# EAGLE design REV_A (EAGLE 7.2.0)
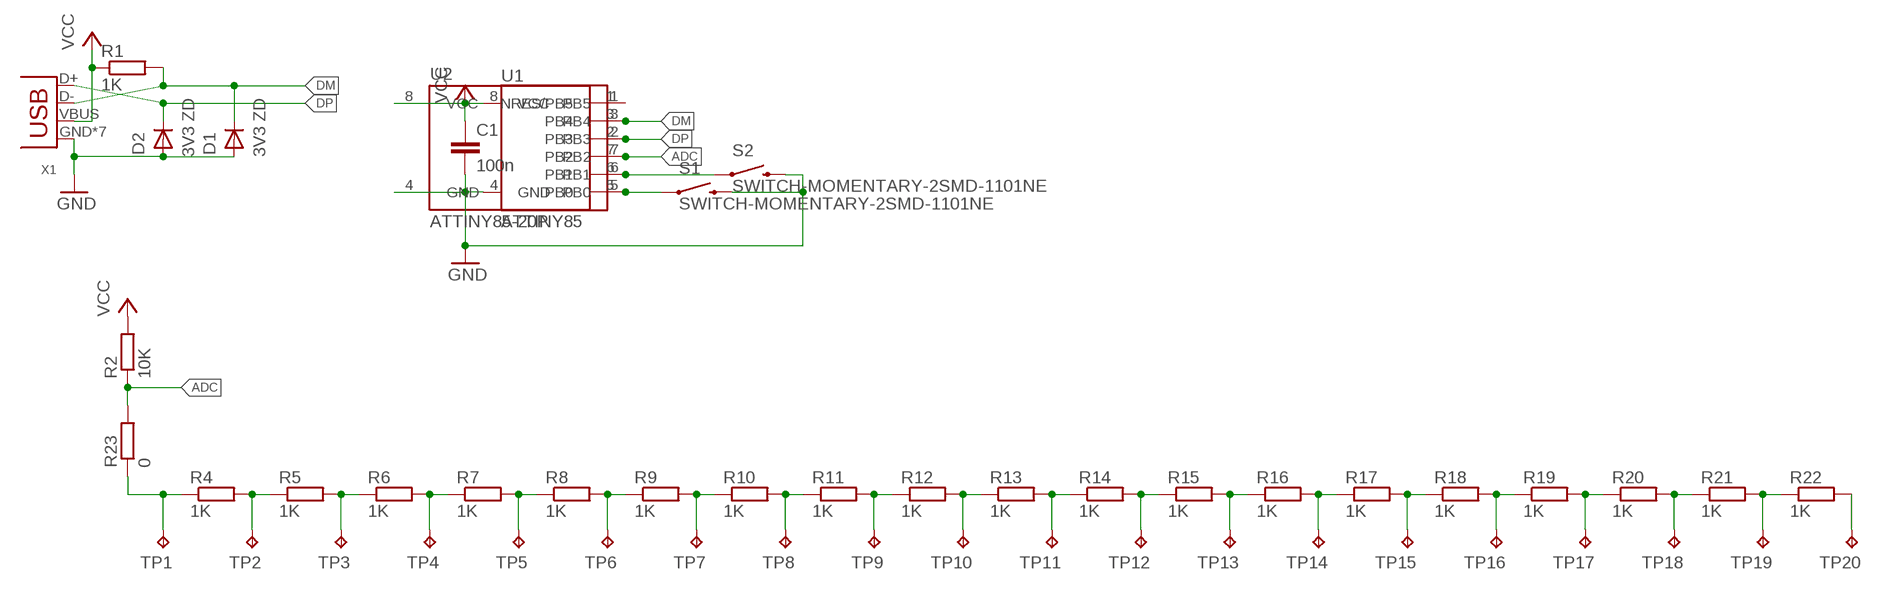
[diagram p0: schematic, sheet 1]

## Parts
C1  100n  C-EUC0805K  [C0805K]
D1  3V3 ZD  BAS32L  [SOD80C]
D2  3V3 ZD  BAS32L  [SOD80C]
R1  1K  R-EU_M0805  [M0805]
R2  10K  R-EU_M0805  [M0805]
R4  1K  R-EU_M0805  [M0805]
R5  1K  R-EU_M0805  [M0805]
R6  1K  R-EU_M0805  [M0805]
R7  1K  R-EU_M0805  [M0805]
R8  1K  R-EU_M0805  [M0805]
R9  1K  R-EU_M0805  [M0805]
R10  1K  R-EU_M0805  [M0805]
R11  1K  R-EU_M0805  [M0805]
R12  1K  R-EU_M0805  [M0805]
R13  1K  R-EU_M0805  [M0805]
R14  1K  R-EU_M0805  [M0805]
R15  1K  R-EU_M0805  [M0805]
R16  1K  R-EU_M0805  [M0805]
R17  1K  R-EU_M0805  [M0805]
R18  1K  R-EU_M0805  [M0805]
R19  1K  R-EU_M0805  [M0805]
R20  1K  R-EU_M0805  [M0805]
R21  1K  R-EU_M0805  [M0805]
R22  1K  R-EU_M0805  [M0805]
R23  0  R-EU_M1206  [M1206]
S1  SWITCH-MOMENTARY-2SMD-1101NE  [TACTILE-SWITCH-1101NE]
S2  SWITCH-MOMENTARY-2SMD-1101NE  [TACTILE-SWITCH-1101NE]
TP1  TPB1,27  [B1,27]
TP2  TPB1,27  [B1,27]
TP3  TPB1,27  [B1,27]
TP4  TPB1,27  [B1,27]
TP5  TPB1,27  [B1,27]
TP6  TPB1,27  [B1,27]
TP7  TPB1,27  [B1,27]
TP8  TPB1,27  [B1,27]
TP9  TPB1,27  [B1,27]
TP10  TPB1,27  [B1,27]
TP11  TPB1,27  [B1,27]
TP12  TPB1,27  [B1,27]
TP13  TPB1,27  [B1,27]
TP14  TPB1,27  [B1,27]
TP15  TPB1,27  [B1,27]
TP16  TPB1,27  [B1,27]
TP17  TPB1,27  [B1,27]
TP18  TPB1,27  [B1,27]
TP19  TPB1,27  [B1,27]
TP20  TPB1,27  [B1,27]
U1  ATTINY85  [ATTINY85]
U2  ATTINY85-20P  [PDIP08_300MIL]
X1  USB-MB-S  [USB-MB-S]

## Nets
1: R4.1 R23.1 TP1.TP
2: R4.2 R5.1 TP2.TP
3: R5.2 R6.1 TP3.TP
4: R6.2 R7.1 TP4.TP
5: R7.2 R8.1 TP5.TP
6: R8.2 R9.1 TP6.TP
7: R9.2 R10.1 TP7.TP
8: R10.2 R11.1 TP8.TP
9: R11.2 R12.1 TP9.TP
10: R12.2 R13.1 TP10.TP
11: R13.2 R14.1 TP11.TP
12: R14.2 R15.1 TP12.TP
13: R15.2 R16.1 TP13.TP
14: R16.2 R17.1 TP14.TP
15: R17.2 R18.1 TP15.TP
16: R18.2 R19.1 TP16.TP
17: R19.2 R20.1 TP17.TP
18: R20.2 R21.1 TP18.TP
19: R21.2 R22.1 TP19.TP
20: R22.2 TP20.TP
ADC: R2.1 R23.2 U1.7(PB2) U2.7(PB2)
DM: D1.1(K) R1.2 U1.3(PB4) U2.3(PB4) X1.D-
DP: D2.1(K) U1.2(PB3) U2.2(PB3) X1.D+
GND: C1.2 D1.2(A) D2.2(A) S1.2 S2.2 U1.4(GND) U2.4(GND) X1.GND X1.P$1(GND) X1.P$2(GND) X1.P$3(GND) X1.P$4(GND) X1.P$5(GND) X1.P$6(GND)
N$1: U1.1(PB5) U2.1(NRES/PB5)
N$20: S1.1 U1.5(PB0) U2.5(PB0)
N$21: S2.1 U1.6(PB1) U2.6(PB1)
VCC: C1.1 R1.1 R2.2 U1.8(VCC) U2.8(VCC) X1.VBUS

## Library data of the parts
C1 = rcl:C-EU: CAPACITOR, European symbol
D1 D2 = nxp_60:BAS32L: High-speed switching diode Single high-speed switching diode, fabricated in planar technology, and encapsulated in a small hermetically sealed glass SOD80C Surface-Mounted Device (SMD) package. AAL Eindhoven MK
R1 R2 R4-R23 = rcl:R-EU_: RESISTOR, European symbol
S1 S2 = SparkFun-Electromechanical:SWITCH-MOMENTARY-2: Various NO switches- pushbuttons, reed, etc; PROD_ID: SWCH-00815
TP1-TP20 = testpad:TP: Test pad
U1 = SparkFun-IC-Microcontroller:ATTINY85; PROD_ID: IC-09092
U2 = _hhn_attiny25_45_85:ATTINY85*: ATMEL ATtiny 85 Packages: P = PDIP 08 30mil S = SOIC 08 EIAJ 208mil Technologies Note: for complete ordering code (temp. range, finish, tape&reel etc.) see www.atmel.com • Supply Voltage: V = (1.8…5.5)V | [blank] = (2.7…5.5)V • Speed: 10 = 10 MHz | 20 = 20 MHz Author: Dipl.-Ing. FH Rainer Bayer HHN Hochschule Heilbronn (Heilbronn University), rainer.bayer@hs-heilbronn.de Ingenieurbüro ing-rb, mail@ing-rb.de
X1 = con-usb-3:USB: USB Connectors

## Board
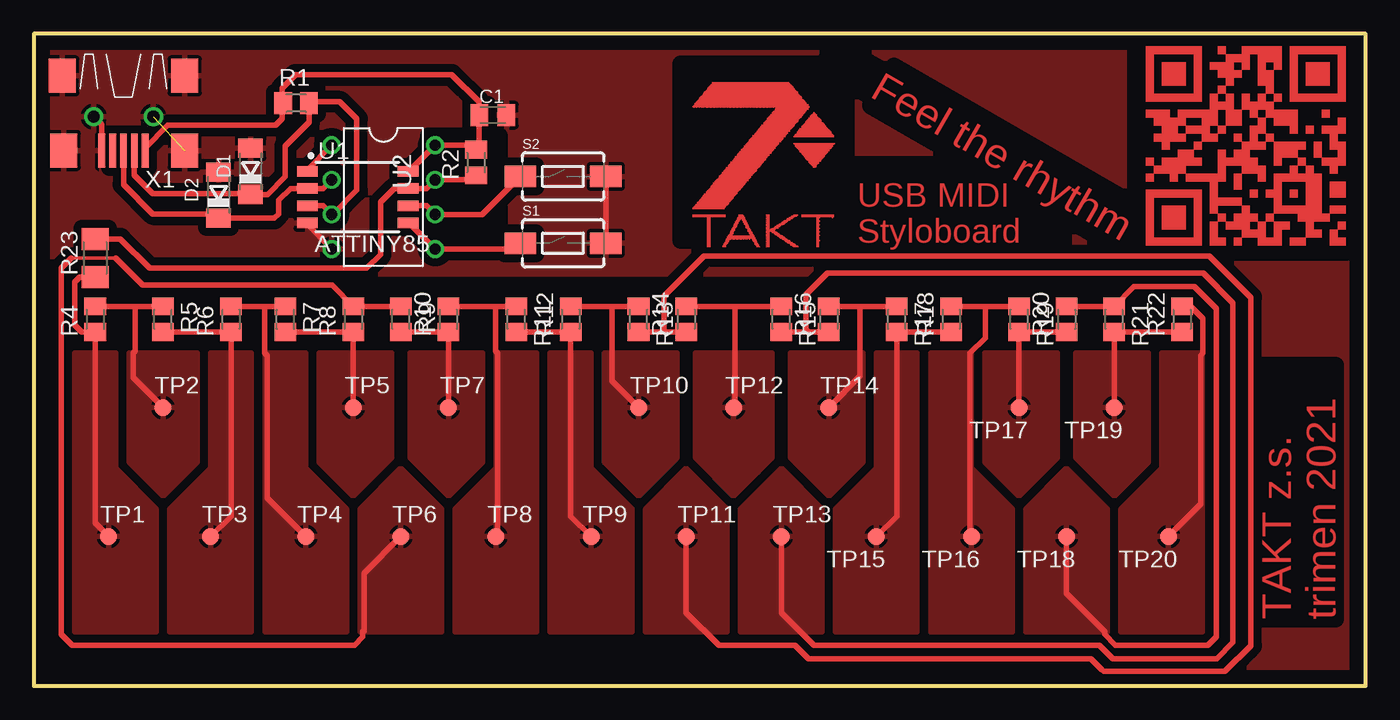
[diagram p1: board, top side]
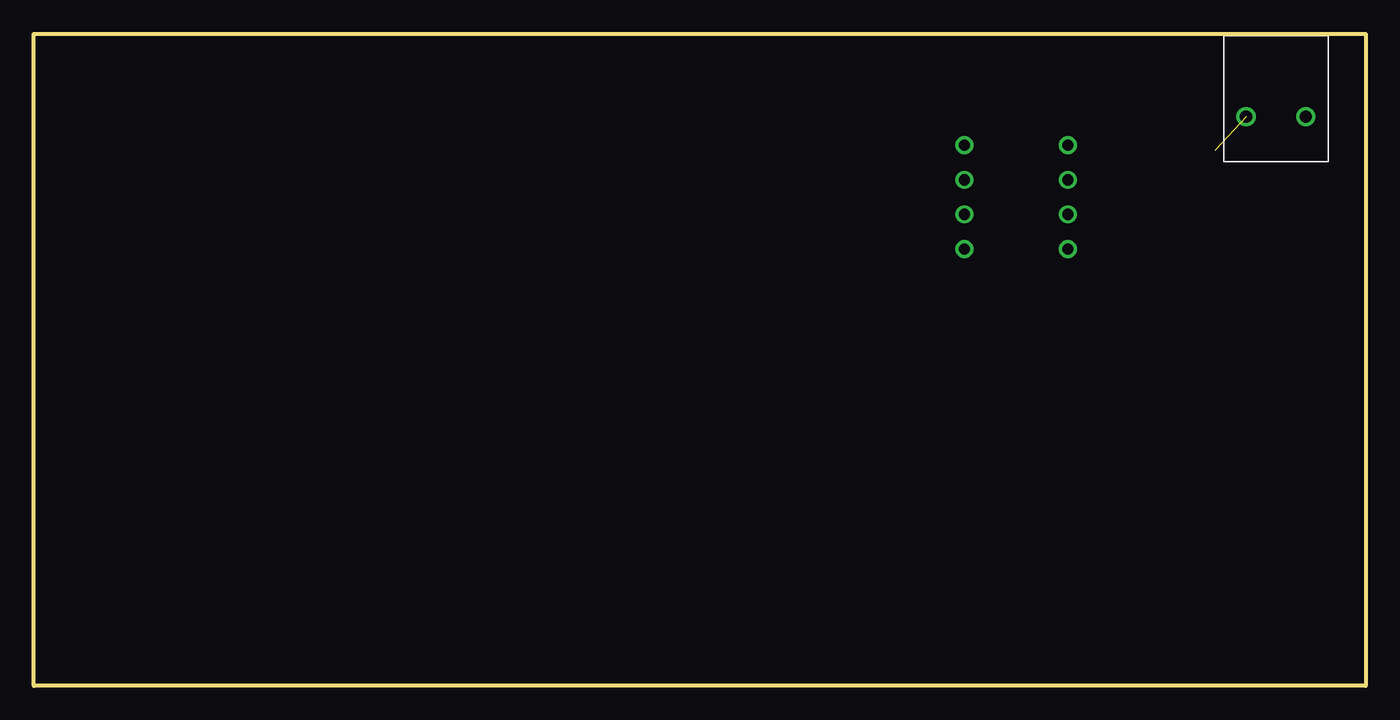
[diagram p2: board, bottom side, seen from below]

Size 98 x 48 mm. Coordinates in mm from the lower left corner, seen from the top.
Outline: 0,0 98,0 98,48 0,48 0,0
Copper layers (1*16): Top 0.035mm / dielectric 1.5mm / Bottom 0.035mm
Design rules "default": minimum track width 10mil, minimum drill 24mil, track to track 8mil, track to pad 8mil, pad to pad 8mil, via to via 8mil, smd to smd 8mil, copper to edge 40mil, drill to drill 8mil, minimum pad ring 10mil, minimum via ring 8mil, stop-mask expansion 4mil, vias tented up to drill 0mil, thermal gap 10mil
tRestrict: area 47.6,32.8 to 59.8,45.8; area 59.8,32.8 to 75.8,38.4; area 81.1,31.9 to 97,47.5; area 61.6,31.3 to 82.9,45.7; area 2.5,25 to 86.5,29.5; area 29,32.5 to 34.2,40.5

### Footprints (pad centres in the part's own frame; a part is rotated, then mirrored left to right if it is on the bottom)
C0805K = smd 1.3 x 1.6: 1 -1,0; 2 1,0
SOD80C = smd 1.4 x 1.8: 1 -1.7,0; 2 1.7,0
M0805 = smd 1.3 x 1.6: 1 -0.95,0; 2 0.95,0
M1206 = smd 1.6 x 2: 1 -1.4,0; 2 1.4,0
TACTILE-SWITCH-1101NE = smd 2.3 x 1.6: 1 -3.15,0; 2 3.15,0
B1,27 = smd 1.27 x 1.27: TP 0,0
ATTINY85 = smd 1.524 x 0.762: 1 -3.683,1.905; 2 -3.683,0.635; 3 -3.683,-0.635; 4 -3.683,-1.905; 5 3.727,-1.905; 6 3.727,-0.635; 7 3.727,0.635; 8 3.727,1.905
PDIP08_300MIL = drill 0.813: 1 -3.81,-3.81; 2 -1.27,-3.81; 3 1.27,-3.81; 4 3.81,-3.81; 5 3.81,3.81; 6 1.27,3.81; 7 -1.27,3.81; 8 -3.81,3.81
USB-MB-S = smd 2.5 x 0.5: D+ 2.5,0; D- 2.5,0.8; GND 2.5,-1.6; ID 2.5,-0.8; VBUS 2.5,1.6 | smd 2.5 x 2: P$1 -3,-4.5; P$2 -3,4.5; P$3 2.5,-4.4; P$4 2.5,4.5 | drill 0.9: P$5 0,2.2; P$6 0,-2.2

### Placement (x,y rotation side)
C1  33.77,42.02 0 top
D1  15.94,37.89 90 top
D2  13.58,36.14 90 top
R1  19.29,42.91 0 top
R2  32.54,38.53 90 top
R4  4.5,27 90 top
R5  9.5,27 270 top
R6  14.5,27 90 top
R7  18.5,27 270 top
R8  23.5,27 90 top
R9  27,27 270 top
R10  30.5,27 90 top
R11  35.5,27 270 top
R12  39.5,27 90 top
R13  44.5,27 270 top
R14  48,27 90 top
R15  55,27 270 top
R16  58.5,27 90 top
R17  63.5,27 270 top
R18  67.5,27 90 top
R19  72.5,27 270 top
R20  76,27 90 top
R21  79.5,27 270 top
R22  84.5,27 90 top
R23  4.5,31.5 90 top
S1  38.94,32.59 0 top
S2  38.94,37.51 0 top
TP1  5.5,11 0 top
TP2  9.5,20.5 0 top
TP3  13,11 0 top
TP4  20,11 0 top
TP5  23.5,20.5 0 top
TP6  27,11 0 top
TP7  30.5,20.5 0 top
TP8  34,11 0 top
TP9  41,11 0 top
TP10  44.5,20.5 0 top
TP11  48,11 0 top
TP12  51.5,20.5 0 top
TP13  55,11 0 top
TP14  58.5,20.5 0 top
TP15  62,11 180 top
TP16  69,11 180 top
TP17  72.5,20.5 180 top
TP18  76,11 180 top
TP19  79.5,20.5 180 top
TP20  83.5,11 180 top
U1  23.81,35.99 0 top
U2  25.72,35.99 270 top
X1  6.59,41.91 270 top

### Tracks (layer width: path | path; a pad name or v marks a point on that pad's centre or on a via)
1
  Top 0.406: TP1.TP 4.5,12 R4.1 3.52,26.05 3.02,26.56 3.02,29.73 3.38,30.1 R23.1
  pour Top: 3,24.5 3,4 9,4 9,13 6,16 6,24.5
2
  Top 0.406: R4.2 7.46,27.95 | 7.46,27.95 R5.1 | TP2.TP 7.3,22.7 7.3,24.5 7.46,24.65 7.46,27.95
  pour Top: 7,24.5 12,24.5 12,16.5 9.5,14 7,16.5
3
  Top 0.406: R5.2 R6.1 14.5,12.5 TP3.TP
  pour Top: 16,24.5 16,4 10,4 10,13 13,16 13,24.5
4
  Top 0.406: R6.2 16.99,27.95 | 16.99,27.95 R7.1 | TP4.TP 17.14,13.86 17.14,24.34 16.99,24.5 16.99,27.95
  pour Top: 17,24.5 17,4 23,4 23,13 20,16 20,24.5
5
  Top 0.406: R7.2 R8.1 TP5.TP
  pour Top: 21,24.5 26.32,24.5 26.32,16.82 23.5,14 21,16.5
6
  Top 0.254: 2.75,31.5 6,31.5
  Top 0.406: R9.1 R8.2 21.95,29.5 8,29.5 6,31.5 | TP6.TP 24.29,8.29 24.29,4.02 24.2,4.02 24.2,3.6 23.6,3 2.8,3 2,3.8 2,30.75 2.75,31.5
  pour Top: 24,4 24,13 27,16 30,13 30,4
7
  Top 0.406: R9.2 R10.1 TP7.TP
  pour Top: 27.68,24.5 33,24.5 33,16.5 30.5,14 27.68,16.82
8
  Top 0.406: R10.2 33.97,27.95 | 33.97,27.95 R11.1 | TP8.TP 34.13,11.13 34.13,24.5 33.97,24.65 33.97,27.95
  pour Top: 37,24.5 37,4 31,4 31,13 34,16 34,24.5
9
  Top 0.406: R11.2 R12.1 39.5,12.5 TP9.TP
  pour Top: 38,24.5 38,4 44,4 44,13 41,16 41,24.5
10
  Top 0.406: R12.2 42.55,27.95 | 42.55,27.95 R13.1 | TP10.TP 42.55,22.45 42.55,27.95
  pour Top: 42,24.5 47.32,24.5 47.32,16.82 44.5,14 42,16.5
11
  Top 0.406: R13.2 46.2,26.05 | 46.2,26.05 R14.1 | TP11.TP 48,5.4 50.4,3 56,3 57,2 77.8,2 78.6,1.2 78.74,1.06 87.65,1.06 89.56,2.97 89.56,28.59 86.52,31.64 49.3,31.64 46.35,28.69 46.35,26.21 46.2,26.05
  pour Top: 45,4 45,13 48,16 51,13 51,4
12
  Top 0.406: R14.2 51.59,27.95 | 51.59,27.95 R15.1 | TP12.TP 51.59,20.59 51.59,27.95
  pour Top: 48.68,24.5 54.32,24.5 54.32,16.82 51.5,14 48.68,16.82
13
  Top 0.406: TP13.TP 55,5.4 57.4,3 78.4,3 79.4,2 87.05,2 88.25,3.2 88.25,28.2 86.05,30.4 58.4,30.4 56.8,28.8 56.8,26.25 57,26.05 | R15.2 57,26.05 | 57,26.05 R16.1
  pour Top: 52,4 52,13 55,16 58,13 58,4
14
  Top 0.406: R16.2 60.8,27.95 | 60.8,27.95 R17.1 | TP14.TP 60.8,22.8 60.8,27.95
  pour Top: 55.68,24.5 61,24.5 61,16.5 58.5,14 55.68,16.82
15
  Top 0.406: R18.1 R17.2 63.5,12.5 TP15.TP
  pour Top: 65,24.5 65,4 59,4 59,13 62,16 62,24.5
16
  Top 0.406: R18.2 70.01,27.95 | 70.01,27.95 R19.1 | TP16.TP 68.9,11 68.9,24.5 70.01,25.61 70.01,27.95
  pour Top: 66,24.5 66,4 72,4 72,13 69,16 69,24.5
17
  Top 0.406: R20.1 R19.2 TP17.TP
  pour Top: 70,24.5 75.32,24.5 75.32,16.82 72.5,14 70,16.5
18
  Top 0.406: R20.2 R21.1 80.95,29.4 85.4,29.4 87,27.8 87,3.6 86.4,3 79.6,3 78.8,3.8 78.8,4 76,6.8 TP18.TP
  pour Top: 73,4 73,13 76,16 79,13 79,4
19
  Top 0.406: R22.1 R21.2 TP19.TP
  pour Top: 76.68,24.5 82,24.5 82,16.5 79.5,14 76.68,16.82
20
  Top 0.406: TP20.TP 85.88,13.38 85.88,24.34 86.04,24.5 86.04,27.04 85.13,27.95 R22.2
  pour Top: 86,24.5 86,4 80,4 80,13 83,16 83,24.5
ADC
  Top 0.406: R2.1 32.22,37.26 U2.7 28.89,36.62 U1.7 26.51,36.62 25.5,35.61 25.5,31.75 24.5,30.75 8.5,30.75 6.35,32.9 R23.2
DM
  Top 0.406: U1.3 21.27,35.35 U2.3 21.97,34.72 23.75,36.5 23.75,41.75 22.5,43 20.34,43 R1.2 20.24,41.49 18.5,39.75 18.5,37.5 17.19,36.19 D1.1 16.38,36.25 8.75,36.25 7.39,37.61 X1.D-
DP
  Top 0.406: U2.2 21.27,36.62 U1.2 18.87,36.62 18,35.75 18,34.75 17.69,34.44 D2.1 13.27,34.75 8.75,34.75 6.59,36.91 X1.D+
GND  (1 unrouted)
  Top 0.406: U1.4 20.13,33.96 U2.4 | S1.2 S2.2 | X1.GND 4.99,41.31 X1.P$6
  pour Top (isolate 0.61): 0,47 0,26 88,26 88,1 98,1 98,47
N$1
  Top 0.406: U1.1 20.13,38.02 U2.1
N$20
  Top 0.406: U1.5 27.62,34.08 U2.5 35.38,32.18 S1.1
N$21
  Top 0.406: U1.6 28.89,35.35 U2.6 33,34.72 S2.1
VCC
  Top 0.406: U1.8 27.62,37.89 U2.8 32.22,39.8 R2.2 32.77,39.48 C1.1 32.75,42.03 32.75,43 30.75,45 19.25,45 18.25,44 18.25,42.81 | X1.VBUS 8.19,39.61 9.85,41.27 17.77,41.27 18.25,41.75 18.25,42.81 | 18.25,42.81 R1.1
(copper drawn outside any net)
  shapes: Top area x3808

### Text on the board
Top: Feel the rhythm | USB MIDI / Styloboard | TAKT z.s. / trimen 2021